# Altium schematic sheet PIC32MM.SchDoc
size A3; SheetNumber: 1; SheetTotal: 4
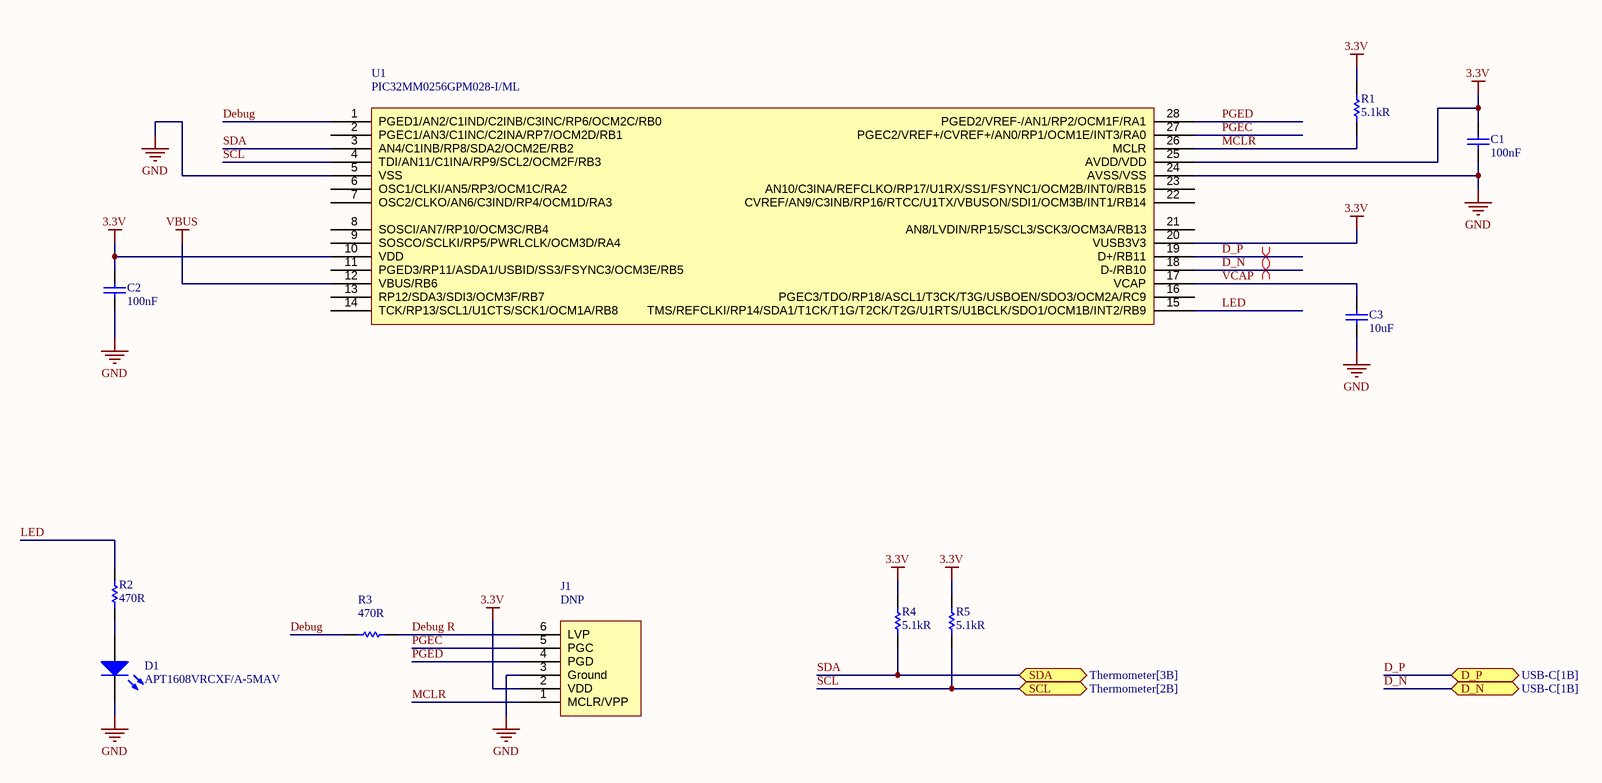
[diagram p0: PIC32MM.SchDoc]

## Parts
C1  100nF  [Capacitor 0402]
C2  100nF  [Capacitor 0402]
C3  10uF  [Capacitor 0402]
D1  APT1608VRCXF/A-5MAV  [LED 0603]
J1  DNP  [Tag Connect No Legs]
R1  5.1kR  [Resistor 0402]
R2  470R  [Resistor 0402]
R3  470R  [Resistor 0402]
R4  5.1kR  [Resistor 0402]
R5  5.1kR  [Resistor 0402]
U1  PIC32MM0256GPM028-I/ML  [QFN-28]

## Ports
D_N (bidir, see USB-C[1B]), D_P (bidir, see USB-C[1B]), SCL (bidir, see Thermometer[2B]), SDA (bidir, see Thermometer[3B])

## Nets
3.3V: C1.2 C2.2 J1.2(VDD) R1.2 R4.2 R5.2 U1.10(VDD) U1.20(VUSB3V3) U1.25(AVDD/VDD)
GND: C1.1 C2.1 C3.1 D1.K J1.3(Ground) U1.5(VSS) U1.24(AVSS/VSS)
VBUS: U1.12(VBUS/RB6)
D_N: U1.18(D-/RB10) ; port D_N
D_P: U1.19(D+/RB11) ; port D_P
Debug: R3.2 U1.1(PGED1/AN2/C1IND/C2INB/C3INC/RP6/OCM2C/RB0)
Debug R: J1.6(LVP) R3.1
LED: R2.2 U1.15(TMS/REFCLKI/RP14/SDA1/T1CK/T1G/T2CK/T2G/U1RTS/U1BCLK/SDO1/OCM1B/INT2/RB9)
MCLR: J1.1(MCLR/VPP) R1.1 U1.26(MCLR)
PGEC: J1.5(PGC) U1.27(PGEC2/VREF+/CVREF+/AN0/RP1/OCM1E/INT3/RA0)
PGED: J1.4(PGD) U1.28(PGED2/VREF-/AN1/RP2/OCM1F/RA1)
SCL: R5.1 U1.4(TDI/AN11/C1INA/RP9/SCL2/OCM2F/RB3) ; port SCL
SDA: R4.1 U1.3(AN4/C1INB/RP8/SDA2/OCM2E/RB2) ; port SDA
VCAP: C3.2 U1.17(VCAP)
NetD1_A: D1.A R2.1

Not connected (* = marked no-connect by the designer): U1 2(PGEC1/AN3/C1INC/C2INA/RP7/OCM2D/RB1) 6(OSC1/CLKI/AN5/RP3/OCM1C/RA2) 7(OSC2/CLKO/AN6/C3IND/RP4/OCM1D/RA3) 8(SOSCI/AN7/RP10/OCM3C/RB4) 9(SOSCO/SCLKI/RP5/PWRLCLK/OCM3D/RA4) 11(PGED3/RP11/ASDA1/USBID/SS3/FSYNC3/OCM3E/RB5) 13(RP12/SDA3/SDI3/OCM3F/RB7) 14(TCK/RP13/SCL1/U1CTS/SCK1/OCM1A/RB8) 16(PGEC3/TDO/RP18/ASCL1/T3CK/T3G/USBOEN/SDO3/OCM2A/RC9) 21(AN8/LVDIN/RP15/SCL3/SCK3/OCM3A/RB13) 22(CVREF/AN9/C3INB/RP16/RTCC/U1TX/VBUSON/SDI1/OCM3B/INT1/RB14) 23(AN10/C3INA/REFCLKO/RP17/U1RX/SS1/FSYNC1/OCM2B/INT0/RB15)

## Layout directives
differential pair: D_N, D_P

## Notes on the sheet
- TITLE
- SIZE
- A3
- VARIANT
- PROJECT
- SHEET
- VERSION
- OF
- AUTHOR
- DATE

## Library data of the parts
C1-C3 = Capacitor
D1 = LED
J1 = MPLAB ICSP
R1-R5 = Resistor